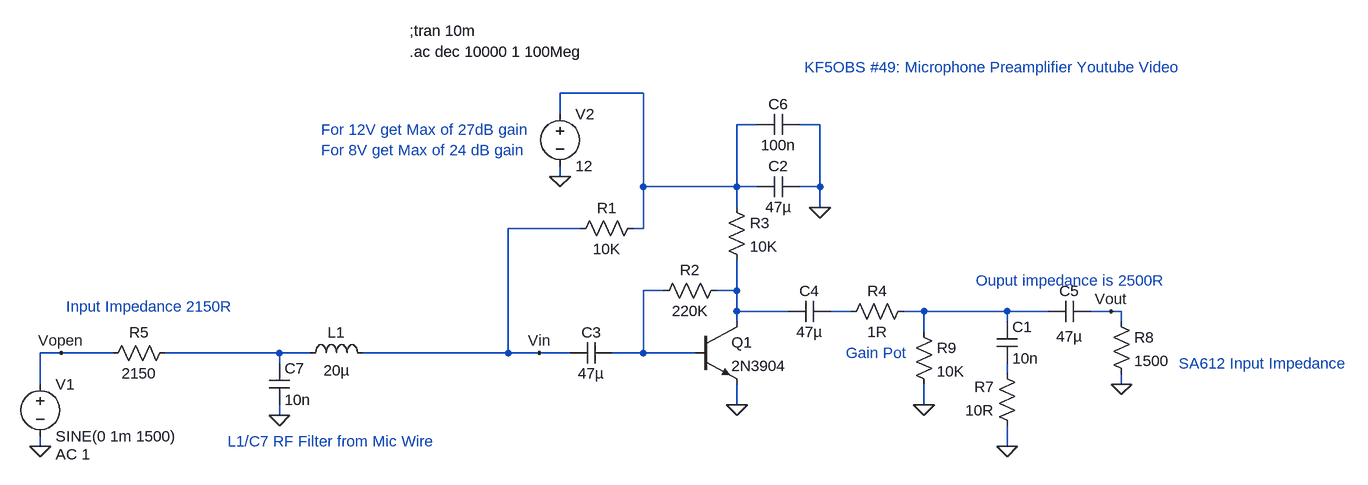
[diagram p0: schematic Mic Preamp.asc]
Mic Preamp.asc, the LTspice schematic file:
Version 4
SHEET 1 1276 680
WIRE 80 -224 -48 -224
WIRE -48 -192 -48 -224
WIRE 256 -176 224 -176
WIRE 352 -176 320 -176
WIRE -48 -96 -48 -112
WIRE 80 -80 80 -224
WIRE 224 -80 224 -176
WIRE 224 -80 80 -80
WIRE 256 -80 224 -80
WIRE 352 -80 352 -176
WIRE 352 -80 320 -80
WIRE 224 -48 224 -80
WIRE 352 -48 352 -80
WIRE -16 -16 -128 -16
WIRE 80 -16 80 -80
WIRE 80 -16 64 -16
WIRE 112 80 80 80
WIRE 224 80 224 32
WIRE 224 80 192 80
WIRE 224 112 224 80
WIRE 304 112 224 112
WIRE 400 112 368 112
WIRE 512 112 480 112
WIRE 640 112 512 112
WIRE 704 112 640 112
WIRE 800 112 768 112
WIRE 816 112 800 112
WIRE 224 128 224 112
WIRE 640 128 640 112
WIRE 816 128 816 112
WIRE 512 144 512 112
WIRE -816 176 -848 176
WIRE -736 176 -816 176
WIRE -480 176 -656 176
WIRE -432 176 -480 176
WIRE -128 176 -128 -16
WIRE -128 176 -352 176
WIRE -80 176 -128 176
WIRE -32 176 -80 176
WIRE 80 176 80 80
WIRE 80 176 32 176
WIRE 160 176 80 176
WIRE -480 192 -480 176
WIRE 640 208 640 192
WIRE -848 224 -848 176
WIRE 816 224 816 208
WIRE 224 256 224 224
WIRE 512 256 512 224
WIRE -480 272 -480 256
WIRE -848 320 -848 304
WIRE 640 320 640 288
FLAG -48 -96 0
FLAG -848 320 0
FLAG 224 256 0
FLAG 352 -48 0
FLAG 640 320 0
FLAG -816 176 Vopen
FLAG -80 176 Vin
FLAG 816 224 0
FLAG 800 112 Vout
FLAG 512 256 0
FLAG -480 272 0
SYMBOL npn 160 128 R0
SYMATTR InstName Q1
SYMATTR Value 2N3904
SYMBOL res 80 -32 R90
WINDOW 0 0 56 VBottom 2
WINDOW 3 32 56 VTop 2
SYMATTR InstName R1
SYMATTR Value 10K
SYMBOL res 208 -64 R0
SYMATTR InstName R3
SYMATTR Value 10K
SYMBOL cap 320 -96 R90
WINDOW 0 0 32 VBottom 2
WINDOW 3 32 32 VTop 2
SYMATTR InstName C2
SYMATTR Value 47µ
SYMBOL cap 32 160 R90
WINDOW 0 0 32 VBottom 2
WINDOW 3 32 32 VTop 2
SYMATTR InstName C3
SYMATTR Value 47µ
SYMBOL voltage -848 208 R0
WINDOW 123 24 124 Left 2
WINDOW 39 0 0 Left 2
SYMATTR Value2 AC 1
SYMATTR InstName V1
SYMATTR Value SINE(0 1m 1500)
SYMBOL voltage -48 -208 R0
WINDOW 123 0 0 Left 2
WINDOW 39 0 0 Left 2
SYMATTR InstName V2
SYMATTR Value 12
SYMBOL res -640 160 R90
WINDOW 0 0 56 VBottom 2
WINDOW 3 32 56 VTop 2
SYMATTR InstName R5
SYMATTR Value 2150
SYMBOL cap 368 96 R90
WINDOW 0 0 32 VBottom 2
WINDOW 3 32 32 VTop 2
SYMATTR InstName C4
SYMATTR Value 47µ
SYMBOL res 656 304 R180
WINDOW 0 36 76 Left 2
WINDOW 3 36 40 Left 2
SYMATTR InstName R7
SYMATTR Value 10R
SYMBOL res 800 112 R0
SYMATTR InstName R8
SYMATTR Value 1500
SYMBOL cap 320 -192 R90
WINDOW 0 0 32 VBottom 2
WINDOW 3 32 32 VTop 2
SYMATTR InstName C6
SYMATTR Value 100n
SYMBOL res 208 64 R90
WINDOW 0 0 56 VBottom 2
WINDOW 3 32 56 VTop 2
SYMATTR InstName R2
SYMATTR Value 220K
SYMBOL cap 624 128 R0
SYMATTR InstName C1
SYMATTR Value 10n
SYMBOL res 496 96 R90
WINDOW 0 0 56 VBottom 2
WINDOW 3 32 56 VTop 2
SYMATTR InstName R4
SYMATTR Value 1R
SYMBOL res 496 128 R0
SYMATTR InstName R9
SYMATTR Value 10K
SYMBOL cap -496 192 R0
SYMATTR InstName C7
SYMATTR Value 10n
SYMBOL ind -448 192 R270
WINDOW 0 32 56 VTop 2
WINDOW 3 5 56 VBottom 2
SYMATTR InstName L1
SYMATTR Value 20µ
SYMBOL cap 768 96 R90
WINDOW 0 0 32 VBottom 2
WINDOW 3 39 32 VTop 2
SYMATTR InstName C5
SYMATTR Value 47µ
TEXT -280 -320 Left 2 !;tran 10m
TEXT 904 192 Left 2 ;SA612 Input Impedance
TEXT -808 104 Left 2 ;Input Impedance 2150R
TEXT 592 64 Left 2 ;Ouput impedance is 2500R
TEXT -280 -288 Left 2 !.ac dec 10000 1 100Meg
TEXT 392 176 Left 2 ;Gain Pot
TEXT -416 -168 Left 2 ;For 12V get Max of 27dB gain\nFor 8V get Max of 24 dB gain
TEXT 328 -264 Left 2 ;KF5OBS #49: Microphone Preamplifier Youtube Video
TEXT -560 312 Left 2 ;L1/C7 RF Filter from Mic Wire

The netlist it stands for:
* Mic Preamp.asc
Q1 N003 N002 0 0 2N3904
R1 N001 Vin 10K
R3 N001 N003 10K
C2 0 N001 47µ
C3 N002 Vin 47µ
V1 Vopen 0 SINE(0 1m 1500) AC 1
V2 N001 0 12
R5 N006 Vopen 2150
C4 N004 N003 47µ
R7 0 N007 10R
R8 Vout 0 1500
C6 0 N001 100n
R2 N003 N002 220K
C1 N005 N007 10n
R4 N005 N004 1R
R9 N005 0 10K
C7 N006 0 10n
L1 N006 Vin 20µ
C5 Vout N005 47µ
.model NPN NPN
.model PNP PNP
.lib standard.bjt
;tran 10m
* SA612 Input Impedance
* Input Impedance 2150R
* Ouput impedance is 2500R
.ac dec 10000 1 100Meg
* Gain Pot
* For 12V get Max of 27dB gain
* For 8V get Max of 24 dB gain
* KF5OBS #49: Microphone Preamplifier Youtube Video
* L1/C7 RF Filter from Mic Wire
.backanno
.end